# Altium schematic sheet sensors.SchDoc
size B
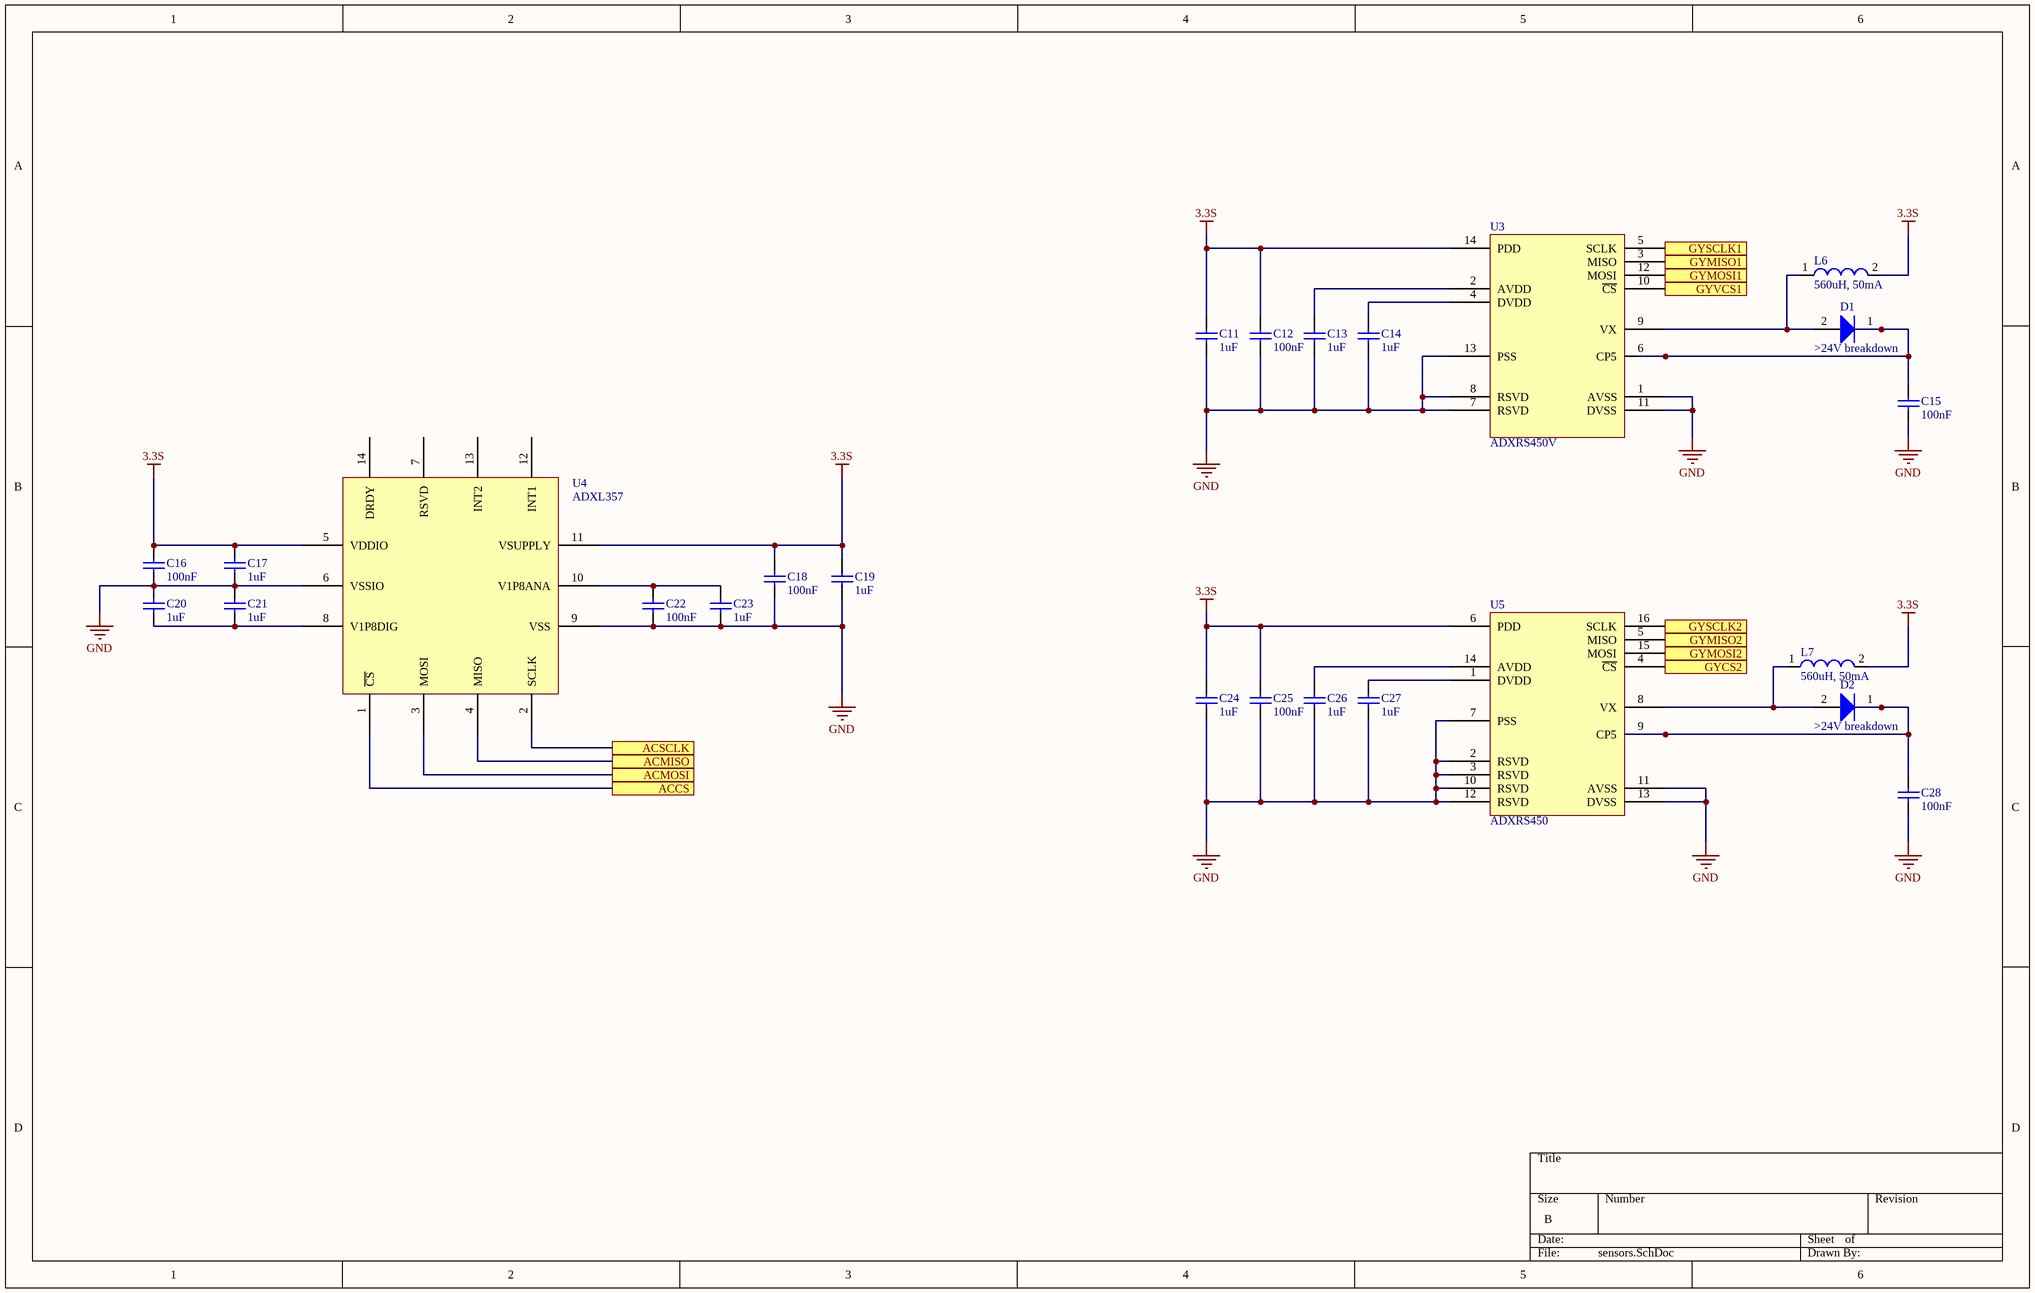
[diagram p0: sensors.SchDoc]

## Parts
C11  1uF  [CAPC1709X95X35LL10T25]
C12  100nF  [CAPC1608X90X40ML10T20]
C13  1uF  [CAPC1709X95X35LL10T25]
C14  1uF  [CAPC1709X95X35LL10T25]
C15  100nF  [CAPC1608X90X40ML10T20]
C16  100nF  [CAPC1608X90X40ML10T20]
C17  1uF  [CAPC1709X95X35LL10T25]
C18  100nF  [CAPC1608X90X40ML10T20]
C19  1uF  [CAPC1709X95X35LL10T25]
C20  1uF  [CAPC1709X95X35LL10T25]
C21  1uF  [CAPC1709X95X35LL10T25]
C22  100nF  [CAPC1608X90X40ML10T20]
C23  1uF  [CAPC1709X95X35LL10T25]
C24  1uF  [CAPC1709X95X35LL10T25]
C25  100nF  [CAPC1608X90X40ML10T20]
C26  1uF  [CAPC1709X95X35LL10T25]
C27  1uF  [CAPC1709X95X35LL10T25]
C28  100nF  [CAPC1608X90X40ML10T20]
D1  >24V breakdown  [ONSC-SOD-323-2-477-02_V]
D2  >24V breakdown  [ONSC-SOD-323-2-477-02_V]
L6  560uH, 50mA  [WE-PD-L]
L7  560uH, 50mA  [WE-PD-L]
U3  ADXRS450V  [LCC127P900X400X915-14N]
U4  ADXL357  [LCCS127P605X560X220-14N]
U5  ADXRS450  [SOIC127P1040X373-16N]

## Ports
ACCS, ACMISO, ACMOSI, ACSCLK, GYCS2, GYMISO1, GYMISO2, GYMOSI1, GYMOSI2, GYSCLK1, GYSCLK2, GYVCS1

## Nets
3.3S: C11.2 C12.2 C16.1 C17.2 C18.1 C19.2 C24.2 C25.2 L6.2 L7.2 U3.14(PDD) U4.5(VDDIO) U4.11(VSUPPLY) U5.6(PDD)
GND: C11.1 C12.1 C13.1 C14.1 C15.1 C16.2 C17.1 C18.2 C19.1 C20.2 C21.2 C22.2 C23.1 C24.1 C25.1 C26.1 C27.1 C28.1 U3.1(AVSS) U3.7(RSVD) U3.8(RSVD) U3.11(DVSS) U3.13(PSS) U4.6(VSSIO) U4.9(VSS) U5.2(RSVD) U5.3(RSVD) U5.7(PSS) U5.10(RSVD) U5.11(AVSS) U5.12(RSVD) U5.13(DVSS)
ACCS: U4.1(~{CS}) ; port ACCS
ACMISO: U4.4(MISO) ; port ACMISO
ACMOSI: U4.3(MOSI) ; port ACMOSI
ACSCLK: U4.2(SCLK) ; port ACSCLK
GYCS2: U5.4(~{CS}) ; port GYCS2
GYMISO1: U3.3(MISO) ; port GYMISO1
GYMISO2: U5.5(MISO) ; port GYMISO2
GYMOSI1: U3.12(MOSI) ; port GYMOSI1
GYMOSI2: U5.15(MOSI) ; port GYMOSI2
GYSCLK1: U3.5(SCLK) ; port GYSCLK1
GYSCLK2: U5.16(SCLK) ; port GYSCLK2
GYVCS1: U3.10(~{CS}) ; port GYVCS1
NetC13_2: C13.2 U3.2(AVDD)
NetC14_2: C14.2 U3.4(DVDD)
NetC15_2: C15.2 D1.1(K) U3.6(CP5)
NetC20_1: C20.1 C21.1 U4.8(V1P8DIG)
NetC22_1: C22.1 C23.2 U4.10(V1P8ANA)
NetC26_2: C26.2 U5.14(AVDD)
NetC27_2: C27.2 U5.1(DVDD)
NetC28_2: C28.2 D2.1(K) U5.9(CP5)
NetD1_2: D1.2(A) L6.1 U3.9(VX)
NetD2_2: D2.2(A) L7.1 U5.8(VX)

Not connected (* = marked no-connect by the designer): U4 7(RSVD) 12(INT1) 13(INT2) 14(DRDY)

## Library data of the parts
C11 C13 C14 C17 C19-C21 C23 C24 C26 C27 = CMP-2000-07531-1: Chip Capacitor, 1 uF, +/- 10%, 50 V, -55 to 125 degC, 0603 (1608 Metric), RoHS, Tape and Reel; Manufacturer: Taiyo Yuden; Voltage Rating: 50V; Dielectric: X7R; Package Reference: 603; Thickness: 0.037inch; Capacitance: 1uF; Width: 0.031inch; Max Operating Temperature: 125degC; Mounting Technology: SurfaceMount; RoHSCompliant: True; Datasheet URL: http://ds.yuden.co.jp/TYCOMPAS/ut/detail.do?productNo=UMK107AB7105KA-T&fileName=UMK107AB7105KA-T_SS&mode=specSheetDownload; Length: 1.6mm; Radiation Hardening: No; Height: 0.8mm; Packaging: TapeandReel; Case/Package: 0603; Mount: SurfaceMount; Halogen Free: HalogenFree; Package Quantity: 1; Package Description: 2-Pin Surface Mount Device, Body 1.65 x 0.85 mm; Manufacturer URL: http://www.t-yuden.com/; Termination: SMD/SMT; Min Operating Temperature: -55degC; Tolerance: 10%; Case Code (Imperial): 0603; Voltage Rating (DC): 50V; Depth: 0.8mm; Datasheet Version: 09/2017; Case Code (Metric): 1608
C12 C15 C16 C18 C22 C25 C28 = CMP-2000-05002-1: Ceramic Multilayer Capacitor, 100 nF, +/- 10%, 50 V, -55 to 155 degC, 0603 (1608 Metric), RoHS, Tape and Reel; Manufacturer: Yageo; Online Catalog: CCSeries; Voltage - Rated: 16V; Product Training Modules: MultilayerCeramicCapacitors; Other Names: 311-1088-6; Featured Product: CommodityMultilayerCeramicCapacitors–CCSeries; Capacitance: 0.1µF; Temperature Coefficient: X7R; Height - Seated (Max): -; Operating Temperature: -55degC~125degC; Package / Case: 0603(1608Metric); Datasheet URL: https://datasheet.ciiva.com/11786/0900766b80d84f1d-11786077.pdf; Package Description: 2-Pin Surface Mount Device, Body 1.6 x 0.8 mm; Family: CeramicCapacitors; Packaging: Digi-Reel; Size / Dimension: 0.063"Lx0.031"W(1.60mmx0.80mm); Thickness (Max): 0.035"(0.90mm); Series: CC; Lead Spacing: -; Features: -; Tolerance: ±10%; Lead Style: -; Ratings: -; Manufacturer URL: http://www.yageo.com/; Package Reference: 603; Standard Package: 1; Category: Capacitors; Mounting Type: SurfaceMount,MLCC; Applications: GeneralPurpose; Datasheet Version: Rev. 2, 05/2009
D1 D2 = CMP-1055-00462-1: Schottky Barrier Diode, 2-Pin SOD-323, Pb-Free, Tape and Reel; PartNumber: BAT54HT1G; Manufacturer: On Semiconductor; Configuration: Single; trr Max (ns): 5; IFSM Max (A): 0.6; ComponentLink3URL: http://www.onsemi.com/pub_link/Collateral/477-02.PDF.1; PackageDescription: 2-Pin SOD, Body 1.7 x 1.25 mm; ComponentLink2URL: http://www.onsemi.cn/pub_link/Collateral/BAT54HT1-D.PDF; ComponentLink3Description: Package Specification; ComponentLink2Description: Datasheet; DatasheetVersion: Rev. 6; PackageReference: SOD-323-2-477-02; RoHS: TRUE; ComponentLink1URL: http://www.onsemi.com/; Packing: Tape and Reel; Mounting Technology: Surface Mount; ComponentLink1Description: Manufacturer URL; PackageVersion: Rev. H, 03/2007
L6 L7 = CMP-0227-00691-1: SMD-Shielded Power Inductor WE-PD, L = 560 µH; Inductance: 560 ÂµH; PackageDescription: SMD Inductor, 2-Leads, Body 12.0 x 12.0 mm; ComponentLink2Description: Datasheet; DatasheetVersion: ver 6, Jun-2005; ComponentLink1Description: Manufacturer Link; PackageVersion: 2006; PackageReference: WE-PD-L; ComponentLink1URL: http://www.we-online.com; ComponentLink2URL: http://www.we-online.de/katalog/media/pdf/74477125.pdf